# EAGLE schematic p0x2 (EAGLE 4.11)
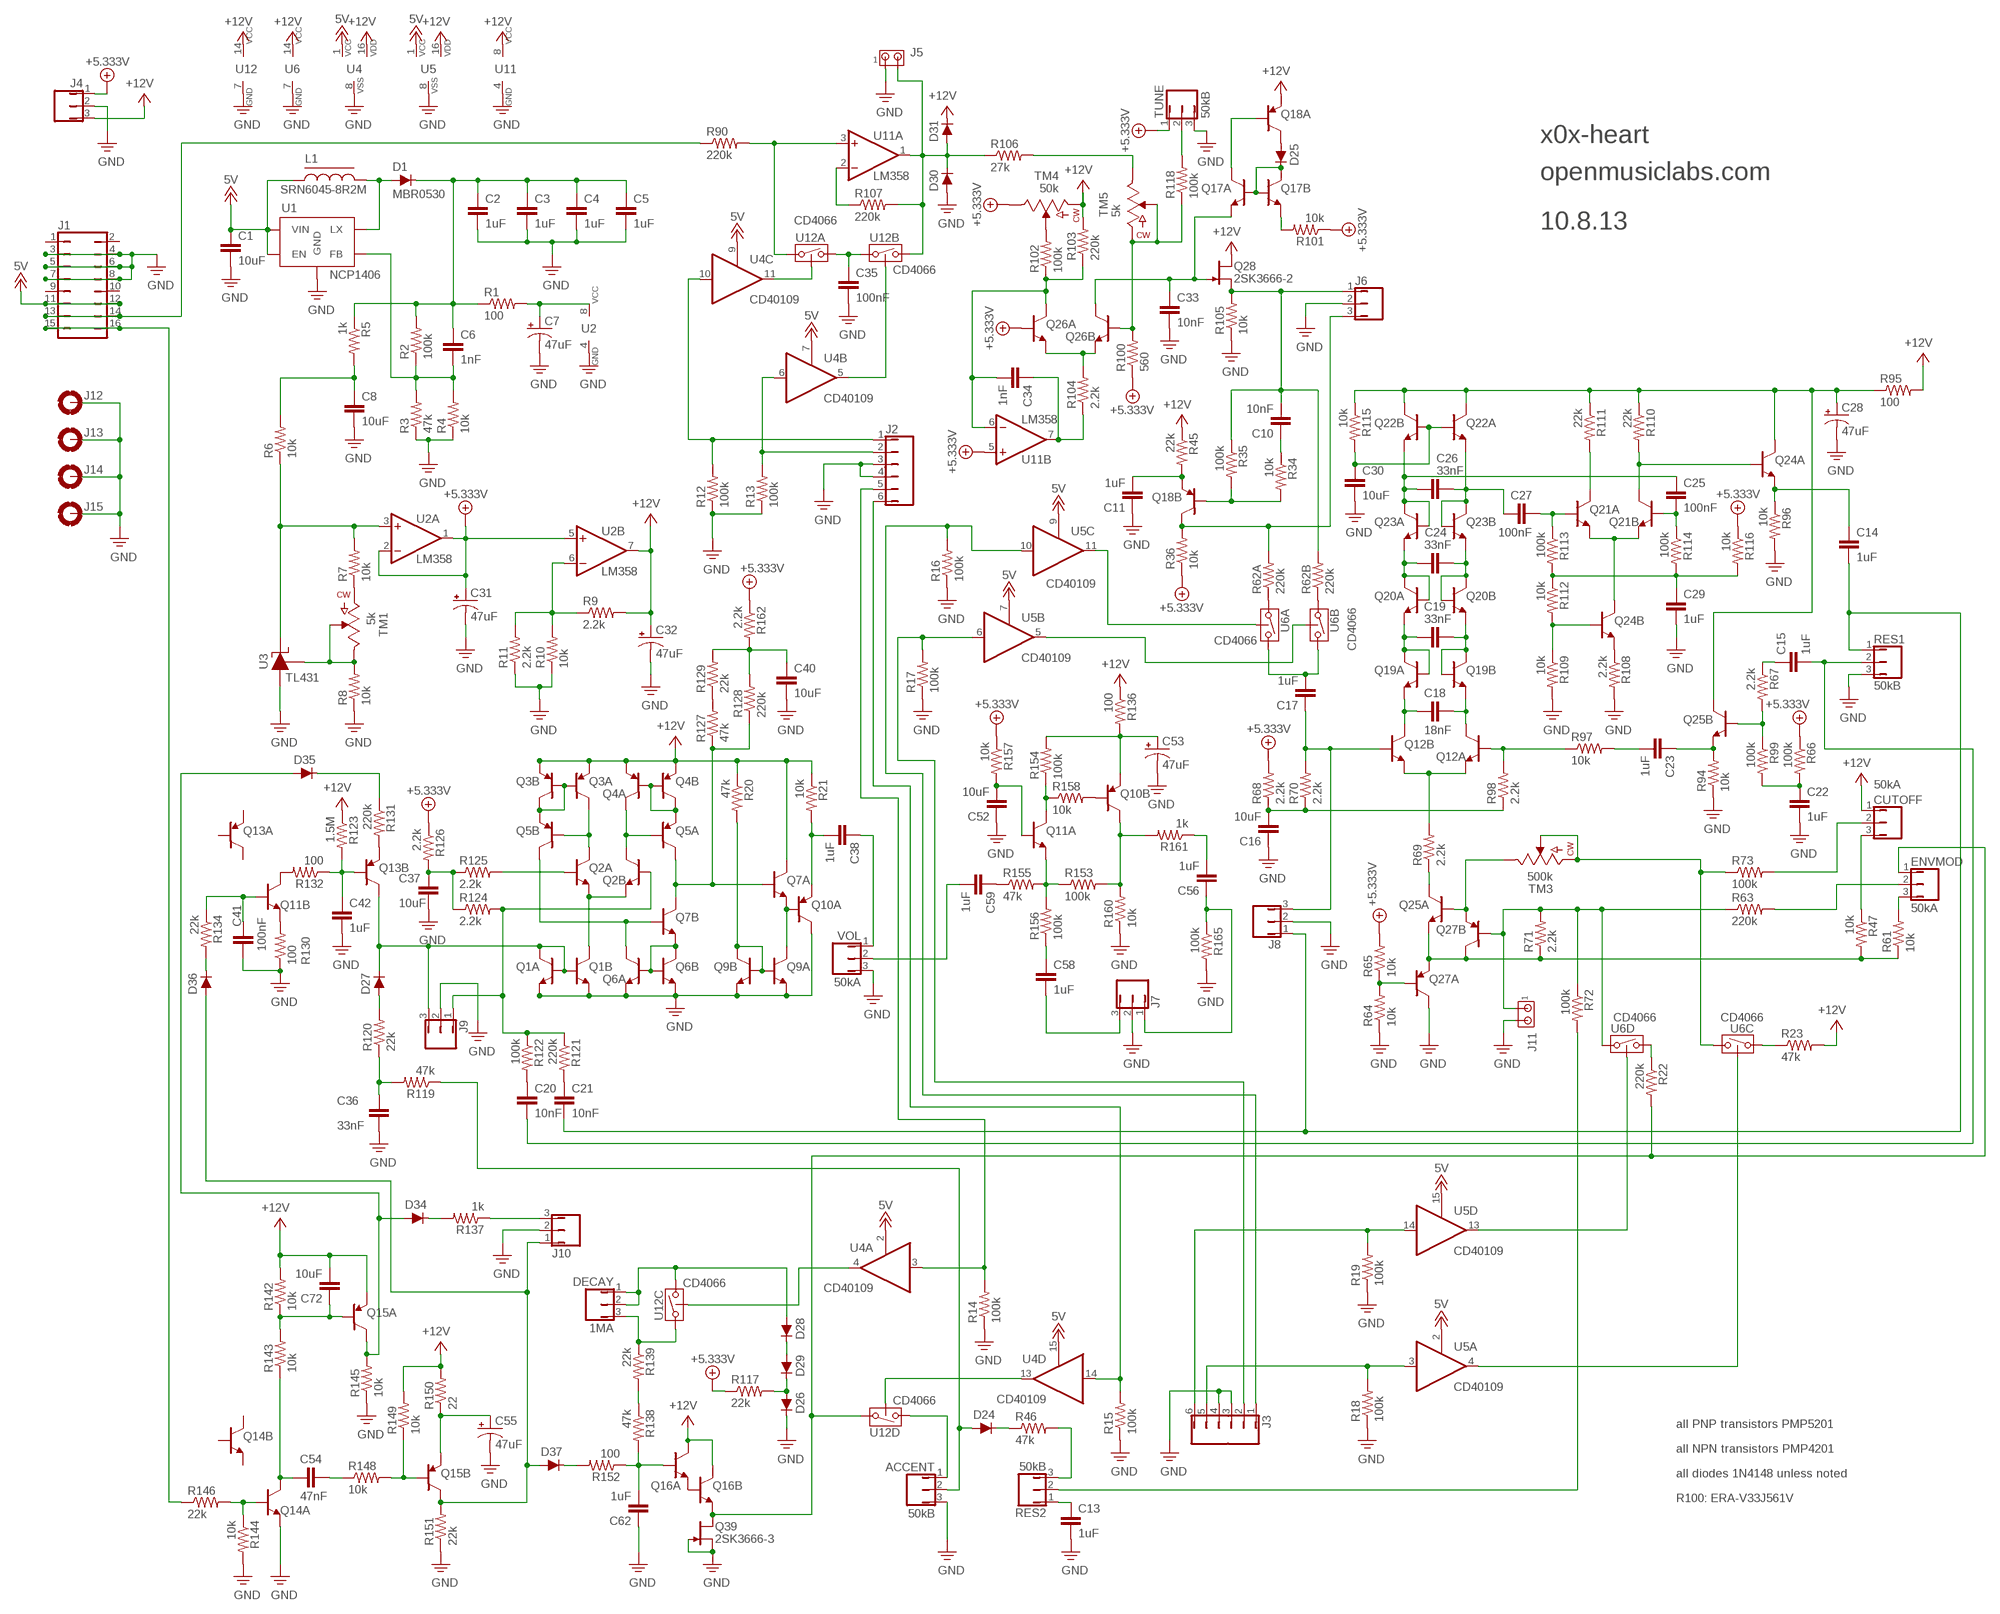
[diagram p0: schematic, sheet 1]

## Parts
ACCENT  50kB  JMP/3P/SIP  [JMP/3P/SIP]
C1  10uF  CAPACITOR0805-SM  [0805/SMALL]
C2  1uF  CAPACITOR0805-SM  [0805/SMALL]
C3  1uF  CAPACITOR0805-SM  [0805/SMALL]
C4  1uF  CAPACITOR0805-SM  [0805/SMALL]
C5  1uF  CAPACITOR0805-SM  [0805/SMALL]
C6  1nF  CAPACITOR0805-SM  [0805/SMALL]
C7  47uF  CAPACITOR-POL6.3X5.3/SMD  [CAP/6.3X5.3/SMD]
C8  10uF  CAPACITOR0805-SM  [0805/SMALL]
C10  10nF  CAPACITOR0805-SM  [0805/SMALL]
C11  1uF  CAPACITOR0805-SM  [0805/SMALL]
C13  1uF  CAPACITOR0805-SM  [0805/SMALL]
C14  1uF  CAPACITOR0805-SM  [0805/SMALL]
C15  1uF  CAPACITOR0805-SM  [0805/SMALL]
C16  10uF  CAPACITOR0805-SM  [0805/SMALL]
C17  1uF  CAPACITOR0805-SM  [0805/SMALL]
C18  18nF  CAPACITOR0805-SM  [0805/SMALL]
C19  33nF  CAPACITOR0805-SM  [0805/SMALL]
C20  10nF  CAPACITOR0805-SM  [0805/SMALL]
C21  10nF  CAPACITOR0805-SM  [0805/SMALL]
C22  1uF  CAPACITOR0805-SM  [0805/SMALL]
C23  1uF  CAPACITOR0805-SM  [0805/SMALL]
C24  33nF  CAPACITOR0805-SM  [0805/SMALL]
C25  100nF  CAPACITOR0805-SM  [0805/SMALL]
C26  33nF  CAPACITOR0805-SM  [0805/SMALL]
C27  100nF  CAPACITOR0805-SM  [0805/SMALL]
C28  47uF  CAPACITOR-POL6.3X5.3/SMD  [CAP/6.3X5.3/SMD]
C29  1uF  CAPACITOR0805-SM  [0805/SMALL]
C30  10uF  CAPACITOR0805-SM  [0805/SMALL]
C31  47uF  CAPACITOR-POL6.3X5.3/SMD  [CAP/6.3X5.3/SMD]
C32  47uF  CAPACITOR-POL6.3X5.3/SMD  [CAP/6.3X5.3/SMD]
C33  10nF  CAPACITOR0805-SM  [0805/SMALL]
C34  1nF  CAPACITOR0805-SM  [0805/SMALL]
C35  100nF  CAPACITOR0805-SM  [0805/SMALL]
C36  33nF  CAPACITOR0805-SM  [0805/SMALL]
C37  10uF  CAPACITOR0805-SM  [0805/SMALL]
C38  1uF  CAPACITOR0805-SM  [0805/SMALL]
C40  10uF  CAPACITOR0805-SM  [0805/SMALL]
C41  100nF  CAPACITOR0805-SM  [0805/SMALL]
C42  1uF  CAPACITOR0805-SM  [0805/SMALL]
C52  10uF  CAPACITOR0805-SM  [0805/SMALL]
C53  47uF  CAPACITOR-POL6.3X5.3/SMD  [CAP/6.3X5.3/SMD]
C54  47nF  CAPACITOR0805-SM  [0805/SMALL]
C55  47uF  CAPACITOR-POL6.3X5.3/SMD  [CAP/6.3X5.3/SMD]
C56  1uF  CAPACITOR0805-SM  [0805/SMALL]
C58  1uF  CAPACITOR0805-SM  [0805/SMALL]
C59  1uF  CAPACITOR0805-SM  [0805/SMALL]
C62  1uF  CAPACITOR0805-SM  [0805/SMALL]
C72  10uF  CAPACITOR0805-SM  [0805/SMALL]
CUTOFF  50kA  JMP/3P/SIP  [JMP/3P/SIP]
D1  MBR0530  DIODESOD-123  [SOD-123]
D24  DIODESOT23-3  [SOT-23-3]
D25  DIODESOT23-3  [SOT-23-3]
D26  DIODESOT23-3  [SOT-23-3]
D27  DIODESOT23-3  [SOT-23-3]
D28  DIODESOT23-3  [SOT-23-3]
D29  DIODESOT23-3  [SOT-23-3]
D30  DIODESOT23-3  [SOT-23-3]
D31  DIODESOT23-3  [SOT-23-3]
D34  DIODESOT23-3  [SOT-23-3]
D35  DIODESOT23-3  [SOT-23-3]
D36  DIODESOT23-3  [SOT-23-3]
D37  DIODESOT23-3  [SOT-23-3]
DECAY  1MA  JMP/3P/SIP  [JMP/3P/SIP]
ENVMOD  50kA  JMP/3P/SIP  [JMP/3P/SIP]
J1  JMP/16P/DIPDIP  [JMP/16P/DIP]
J2  JMP/6P/SIP  [JMP/6P/SIP]
J3  JMP/6P/SIP  [JMP/6P/SIP]
J4  JMP/3P/SIP  [JMP/3P/SIP]
J5  JMP/2P/SIP  [JMP/2P/SIP]
J6  JMP/3P/SIP  [JMP/3P/SIP]
J7  JMP/3P/SIP  [JMP/3P/SIP]
J8  JMP/3P/SIP  [JMP/3P/SIP]
J9  JMP/3P/SIP  [JMP/3P/SIP]
J10  JMP/3P/SIP  [JMP/3P/SIP]
J11  JMP/2P/SIP  [JMP/2P/SIP]
J12  HOLE-PAD4/40  [H0LE/PAD/4-40]
J13  HOLE-PAD4/40  [H0LE/PAD/4-40]
J14  HOLE-PAD4/40  [H0LE/PAD/4-40]
J15  HOLE-PAD4/40  [H0LE/PAD/4-40]
L1  SRN6045-8R2M  INDUCTORSRN6045  [SRN6045]
Q1  NPN-DUALPMP4201  [SOT363]
Q2  NPN-DUALPMP4201  [SOT363]
Q3  PNP-DUALPMP5201  [SOT363]
Q4  PNP-DUALPMP5201  [SOT363]
Q5  PNP-DUALPMP5201  [SOT363]
Q6  NPN-DUALPMP4201  [SOT363]
Q7  NPN-DUALPMP4201  [SOT363]
Q9  NPN-DUALPMP4201  [SOT363]
Q10  PNP-DUALPMP5201  [SOT363]
Q11  NPN-DUALPMP4201  [SOT363]
Q12  NPN-DUALPMP4201  [SOT363]
Q13  PNP-DUALPMP5201  [SOT363]
Q14  NPN-DUALPMP4201  [SOT363]
Q15  PNP-DUALPMP5201  [SOT363]
Q16  NPN-DUALPMP4201  [SOT363]
Q17  NPN-DUALPMP4201  [SOT363]
Q18  PNP-DUALPMP5201  [SOT363]
Q19  NPN-DUALPMP4201  [SOT363]
Q20  NPN-DUALPMP4201  [SOT363]
Q21  NPN-DUALPMP4201  [SOT363]
Q22  NPN-DUALPMP4201  [SOT363]
Q23  NPN-DUALPMP4201  [SOT363]
Q24  NPN-DUALPMP4201  [SOT363]
Q25  NPN-DUALPMP4201  [SOT363]
Q26  NPN-DUALPMP4201  [SOT363]
Q27  PNP-DUALPMP5201  [SOT363]
Q28  2SK3666-2  JFET/NSOT23-3  [SOT-23-3]
Q39  2SK3666-3  JFET/NSOT23-3  [SOT-23-3]
R1  100  RESISTOR0603-SM  [0603-SM]
R2  100k  RESISTOR0603-SM  [0603-SM]
R3  47k  RESISTOR0603-SM  [0603-SM]
R4  10k  RESISTOR0603-SM  [0603-SM]
R5  1k  RESISTOR0603-SM  [0603-SM]
R6  10k  RESISTOR0603-SM  [0603-SM]
R7  10k  RESISTOR0603-SM  [0603-SM]
R8  10k  RESISTOR0603-SM  [0603-SM]
R9  2.2k  RESISTOR0603-SM  [0603-SM]
R10  10k  RESISTOR0603-SM  [0603-SM]
R11  2.2k  RESISTOR0603-SM  [0603-SM]
R12  100k  RESISTOR0603-SM  [0603-SM]
R13  100k  RESISTOR0603-SM  [0603-SM]
R14  100k  RESISTOR0603-SM  [0603-SM]
R15  100k  RESISTOR0603-SM  [0603-SM]
R16  100k  RESISTOR0603-SM  [0603-SM]
R17  100k  RESISTOR0603-SM  [0603-SM]
R18  100k  RESISTOR0603-SM  [0603-SM]
R19  100k  RESISTOR0603-SM  [0603-SM]
R20  47k  RESISTOR0603-SM  [0603-SM]
R21  10k  RESISTOR0603-SM  [0603-SM]
R22  220k  RESISTOR0603-SM  [0603-SM]
R23  47k  RESISTOR0603-SM  [0603-SM]
R34  10k  RESISTOR0603-SM  [0603-SM]
R35  100k  RESISTOR0603-SM  [0603-SM]
R36  10k  RESISTOR0603-SM  [0603-SM]
R45  22k  RESISTOR0603-SM  [0603-SM]
R46  47k  RESISTOR0603-SM  [0603-SM]
R47  10k  RESISTOR0603-SM  [0603-SM]
R61  10k  RESISTOR0603-SM  [0603-SM]
R62A  220k  RESISTOR0603-SM  [0603-SM]
R62B  220k  RESISTOR0603-SM  [0603-SM]
R63  220k  RESISTOR0603-SM  [0603-SM]
R64  10k  RESISTOR0603-SM  [0603-SM]
R65  10k  RESISTOR0603-SM  [0603-SM]
R66  100k  RESISTOR0603-SM  [0603-SM]
R67  2.2k  RESISTOR0603-SM  [0603-SM]
R68  2.2k  RESISTOR0603-SM  [0603-SM]
R69  2.2k  RESISTOR0603-SM  [0603-SM]
R70  2.2k  RESISTOR0603-SM  [0603-SM]
R71  2.2k  RESISTOR0603-SM  [0603-SM]
R72  100k  RESISTOR0603-SM  [0603-SM]
R73  100k  RESISTOR0603-SM  [0603-SM]
R90  220k  RESISTOR0603-SM  [0603-SM]
R94  10k  RESISTOR0603-SM  [0603-SM]
R95  100  RESISTOR0603-SM  [0603-SM]
R96  10k  RESISTOR0603-SM  [0603-SM]
R97  10k  RESISTOR0603-SM  [0603-SM]
R98  2.2k  RESISTOR0603-SM  [0603-SM]
R99  100k  RESISTOR0603-SM  [0603-SM]
R100  560  RESISTOR0603-SM  [0603-SM]
R101  10k  RESISTOR0603-SM  [0603-SM]
R102  100k  RESISTOR0603-SM  [0603-SM]
R103  220k  RESISTOR0603-SM  [0603-SM]
R104  2.2k  RESISTOR0603-SM  [0603-SM]
R105  10k  RESISTOR0603-SM  [0603-SM]
R106  27k  RESISTOR0603-SM  [0603-SM]
R107  220k  RESISTOR0603-SM  [0603-SM]
R108  2.2k  RESISTOR0603-SM  [0603-SM]
R109  10k  RESISTOR0603-SM  [0603-SM]
R110  22k  RESISTOR0603-SM  [0603-SM]
R111  22k  RESISTOR0603-SM  [0603-SM]
R112  10k  RESISTOR0603-SM  [0603-SM]
R113  100k  RESISTOR0603-SM  [0603-SM]
R114  100k  RESISTOR0603-SM  [0603-SM]
R115  10k  RESISTOR0603-SM  [0603-SM]
R116  10k  RESISTOR0603-SM  [0603-SM]
R117  22k  RESISTOR0603-SM  [0603-SM]
R118  100k  RESISTOR0603-SM  [0603-SM]
R119  47k  RESISTOR0603-SM  [0603-SM]
R120  22k  RESISTOR0603-SM  [0603-SM]
R121  220k  RESISTOR0603-SM  [0603-SM]
R122  100k  RESISTOR0603-SM  [0603-SM]
R123  1.5M  RESISTOR0603-SM  [0603-SM]
R124  2.2k  RESISTOR0603-SM  [0603-SM]
R125  2.2k  RESISTOR0603-SM  [0603-SM]
R126  2.2k  RESISTOR0603-SM  [0603-SM]
R127  47k  RESISTOR0603-SM  [0603-SM]
R128  220k  RESISTOR0603-SM  [0603-SM]
R129  22k  RESISTOR0603-SM  [0603-SM]
R130  100  RESISTOR0603-SM  [0603-SM]
R131  220k  RESISTOR0603-SM  [0603-SM]
R132  100  RESISTOR0603-SM  [0603-SM]
R134  22k  RESISTOR0603-SM  [0603-SM]
R136  100  RESISTOR0603-SM  [0603-SM]
R137  1k  RESISTOR0603-SM  [0603-SM]
R138  47k  RESISTOR0603-SM  [0603-SM]
R139  22k  RESISTOR0603-SM  [0603-SM]
R142  10k  RESISTOR0603-SM  [0603-SM]
R143  10k  RESISTOR0603-SM  [0603-SM]
R144  10k  RESISTOR0603-SM  [0603-SM]
R145  10k  RESISTOR0603-SM  [0603-SM]
R146  22k  RESISTOR0603-SM  [0603-SM]
R148  10k  RESISTOR0603-SM  [0603-SM]
R149  10k  RESISTOR0603-SM  [0603-SM]
R150  22  RESISTOR0603-SM  [0603-SM]
R151  22k  RESISTOR0603-SM  [0603-SM]
R152  100  RESISTOR0603-SM  [0603-SM]
R153  100k  RESISTOR0603-SM  [0603-SM]
R154  100k  RESISTOR0603-SM  [0603-SM]
R155  47k  RESISTOR0603-SM  [0603-SM]
R156  100k  RESISTOR0603-SM  [0603-SM]
R157  10k  RESISTOR0603-SM  [0603-SM]
R158  10k  RESISTOR0603-SM  [0603-SM]
R160  10k  RESISTOR0603-SM  [0603-SM]
R161  1k  RESISTOR0603-SM  [0603-SM]
R162  2.2k  RESISTOR0603-SM  [0603-SM]
R165  100k  RESISTOR0603-SM  [0603-SM]
RES1  50kB  JMP/3P/SIP  [JMP/3P/SIP]
RES2  50kB  JMP/3P/SIP  [JMP/3P/SIP]
TM1  5k  POT/TRIMTC33X  [TC33X]
TM3  500k  POT/TRIMTC33X  [TC33X]
TM4  50k  POT/TRIMTC33X  [TC33X]
TM5  5k  POT/TRIMTC33X  [TC33X]
TUNE  50kB  JMP/3P/SIP  [JMP/3P/SIP]
U1  NCP1406  NCP1406SOT23-5  [SOT23-5]
U2  LM358  OPAMP/DUALSOIC  [8-SOIC]
U3  TL431  TL431SOT23-3  [SOT-23-3]
U4  CD40109  CD40109WIDE  [16-SOIC/WIDE]
U5  CD40109  CD40109WIDE  [16-SOIC/WIDE]
U6  CD4066  CD4066SOIC  [14-SOIC]
U11  LM358  OPAMP/DUALSOIC  [8-SOIC]
U12  CD4066  CD4066SOIC  [14-SOIC]
VOL  50kA  JMP/3P/SIP  [JMP/3P/SIP]

## Nets
+5V: C31.P$1(+) J4.1 Q26.P$1 R36.P$1 R65.P$2 R66.P$1 R68.P$2 R100.P$1 R101.P$1 R116.P$1 R117.P$1 R126.P$1 R157.P$1 R162.P$1 TM4.P$3 TUNE.1 U2.1(A:OUT) U2.2(A:-IN) U2.5(B:+IN) U11.5(B:+IN) ; supply symbol labelled +5.333V
+12V: C1.1 J1.11 J1.12 L1.P$1 U1.P$1(EN) U1.P$3(VIN) U4.1(VCC) U4.2(A:OE) U4.7(B:OE) U4.9(C:OE) U4.15(D:OE) U5.1(VCC) U5.2(A:OE) U5.7(B:OE) U5.9(C:OE) U5.15(D:OE) ; supply symbol labelled 5V
ENVMOD: ENVMOD.1 Q16.P$4 Q39.P$2 R22.P$2 U12.10
N$1: J10.3 R137.P$1
N$2: R138.P$1 R139.P$2
N$3: R22.P$1 U6.11
N$4: R90.P$2 U11.3(A:+IN) U12.1
N$5: D30.P$1(C) D31.P$3(A) J5.2 R106.P$1 R107.P$2 U11.1(A:OUT) U12.4
N$6: R107.P$1 U11.2(A:-IN)
N$7: Q26.P$4 Q26.P$5 R104.P$2
N$8: C34.1 R104.P$1 U11.7(B:OUT)
N$9: C34.2 Q26.P$6 R102.P$1 R103.P$1 U11.6(B:-IN)
N$10: R106.P$2 TM5.P$3
N$11: C33.1 Q17.P$5 Q26.P$3 Q28.P$1
N$12: R62A.P$1 U6.1
N$13: C13.1 RES2.1
N$14: C10.2 J6.1 Q28.P$3 R35.P$1 R62B.P$2 R105.P$2
N$15: Q17.P$4 R101.P$2
N$16: D25.P$3(A) Q18.P$6
N$17: D25.P$1(C) Q17.P$1 Q17.P$2 Q17.P$3
N$18: Q17.P$6 Q18.P$1
N$19: C11.2 Q18.P$4 R45.P$2
N$20: J6.3 Q18.P$3 R36.P$2 R62A.P$2
N$21: Q18.P$2 R34.P$2 R35.P$2
N$22: R62B.P$1 U6.3
N$23: C10.1 R34.P$1
N$24: C17.1 J8.3 Q12.P$2 R70.P$2
N$25: Q12.P$4 Q12.P$5 R69.P$2
N$26: C18.2 Q12.P$3 Q19.P$5
N$27: C19.2 Q19.P$1 Q19.P$6 Q20.P$5
N$28: C24.2 Q20.P$1 Q20.P$6 Q23.P$5
N$29: C19.1 Q19.P$2 Q19.P$3 Q20.P$4
N$30: C18.1 Q12.P$6 Q19.P$4
N$31: C24.1 Q20.P$2 Q20.P$3 Q23.P$4
N$32: C26.1 C27.2 Q22.P$5 Q23.P$2 Q23.P$3
N$33: C25.1 C26.2 Q22.P$4 Q23.P$1 Q23.P$6
N$34: C30.1 Q22.P$1 Q22.P$2 R115.P$2
N$35: C16.2 R68.P$1 R70.P$1 R98.P$1
N$36: Q12.P$1 R97.P$1 R98.P$2
N$37: Q25.P$5 Q27.P$3 Q27.P$5 R47.P$2 R61.P$1 R71.P$1
N$38: Q27.P$1 R64.P$2 R65.P$1
N$39: Q25.P$1 Q27.P$4 TM3.P$3
N$40: J1.13 J1.14 R90.P$1
N$41: Q25.P$6 R69.P$1
N$42: C28.P$1(+) Q22.P$3 Q22.P$6 Q24.P$6 Q25.P$3 R95.P$1 R110.P$1 R111.P$1 R115.P$1
N$43: C25.2 Q21.P$2 R114.P$1
N$44: Q21.P$4 Q21.P$5 Q24.P$3
N$45: Q21.P$3 Q24.P$1 R110.P$2
N$46: Q21.P$6 R111.P$2
N$47: C29.1 R112.P$1 R113.P$2 R114.P$2 R116.P$2
N$48: C27.1 Q21.P$1 R113.P$1
N$49: C14.1 Q24.P$5 R96.P$1
N$50: Q24.P$4 R108.P$1
N$51: Q24.P$2 R109.P$1 R112.P$2
N$52: C14.2 C21.2 J8.1 RES1.1
N$53: R73.P$1 TM3.P$1 TM3.P$2 U6.9
N$54: C15.2 C20.2 RES1.2
N$55: C15.1 R67.P$1
N$56: CUTOFF.2 R73.P$2
N$57: C22.1 R66.P$2 R99.P$2
N$58: C23.1 Q25.P$4 R94.P$2
N$59: ENVMOD.3 R61.P$2
N$60: CUTOFF.3 R47.P$1
N$61: ENVMOD.2 R63.P$2
N$62: R72.P$2 RES2.2
N$63: J2.2 R13.P$2 U4.6(B:I)
N$64: D28.P$1(C) D29.P$3(A)
N$65: Q16.P$2 Q16.P$5
N$66: D26.P$3(A) D29.P$1(C) R117.P$2
N$67: C62.2 Q16.P$1 R138.P$2 R152.P$1
N$68: D37.P$1(C) R152.P$2
N$69: DECAY.3 R139.P$1 U12.8
N$71: D28.P$3(A) DECAY.1 DECAY.2 U12.9
N$72: C35.1 U12.2 U12.3
N$73: U4.5(B:O) U12.5
N$74: U4.11(C:O) U12.13
N$75: C17.2 U6.2 U6.4
N$76: U4.4(A:O) U12.6
N$77: C58.1 R156.P$1
N$78: ACCENT.1 U12.11
N$79: ACCENT.2 D24.P$3(A) R119.P$1
N$80: R46.P$2 RES2.3
N$81: D24.P$1(C) R46.P$1
N$82: U4.13(D:O) U12.12
N$83: J11.1 Q27.P$2 R63.P$1 R71.P$2 R72.P$1 U6.10
N$84: Q14.P$1 R144.P$1 R146.P$2
N$85: C54.2 Q14.P$6 R143.P$1
N$86: U5.5(B:O) U6.5
N$87: D27.P$1(C) J9.3 Q1.P$1 Q1.P$2 Q1.P$6 Q13.P$3
N$88: U5.11(C:O) U6.13
N$89: Q15.P$2 R148.P$2 R149.P$1
N$90: C55.P$1(+) Q15.P$4 R150.P$1
N$91: Q1.P$3 Q2.P$4 Q2.P$5
N$92: D36.P$3(A) D37.P$3(A) J10.1 Q15.P$3 R151.P$2
N$93: D34.P$3(A) D35.P$3(A) Q15.P$6 R145.P$2
N$94: Q4.P$1 Q4.P$2 Q4.P$3 Q5.P$5
N$95: Q3.P$1 Q3.P$2 Q3.P$3 Q5.P$4
N$96: Q2.P$3 Q4.P$6 Q5.P$1
N$97: Q6.P$1 Q6.P$2 Q6.P$3 Q7.P$4
N$98: Q5.P$6 Q7.P$1 Q7.P$3 R127.P$1 R128.P$1
N$99: Q13.P$4 R131.P$2
N$100: Q2.P$6 Q3.P$6 Q5.P$2
N$101: Q5.P$3 Q6.P$6 Q7.P$2
N$102: Q9.P$1 Q9.P$2 Q9.P$3 R20.P$2
N$103: Q7.P$5 Q9.P$6 Q10.P$1
N$104: C56.1 J7.1 R165.P$1
N$105: C38.2 Q10.P$5 R21.P$2
N$106: C38.1 VOL.1
N$107: C59.2 VOL.2
N$108: C59.1 R155.P$1
N$109: C52.2 Q11.P$1 R157.P$2
N$110: Q10.P$2 R158.P$2
N$111: Q10.P$3 R153.P$2 R160.P$2 R161.P$2
N$112: Q11.P$5 R153.P$1 R155.P$2 R156.P$2
N$113: Q11.P$6 R154.P$1 R158.P$1
N$114: C53.P$1(+) Q10.P$4 R136.P$2 R154.P$2
N$115: C56.2 R161.P$1
N$116: R127.P$2 R129.P$1
N$117: J1.15 J1.16 R146.P$1
N$118: C40.1 R128.P$2 R129.P$2 R162.P$2
N$119: C42.1 Q13.P$2 R123.P$2 R132.P$1
N$120: Q11.P$3 R132.P$2
N$121: Q11.P$4 R130.P$2
N$122: C41.1 Q11.P$2 R134.P$1
N$123: D36.P$1(C) R134.P$2
N$124: D35.P$1(C) R131.P$1
N$125: D27.P$3(A) R120.P$2
N$126: C36.1 R119.P$2 R120.P$1
N$127: J9.1 Q2.P$2 R121.P$1 R122.P$1 R124.P$2
N$128: Q2.P$1 R125.P$2
N$129: C37.1 R124.P$1 R125.P$1 R126.P$2
N$130: C21.1 R121.P$2
N$131: C20.1 R122.P$2
N$132: C23.2 R97.P$2
N$133: U5.13(D:O) U6.12
N$134: U5.4(A:O) U6.6
N$135: C7.P$1(+) R1.P$2 U2.8(VCC)
N$136: C6.2 R2.P$1 R3.P$2 R4.P$2 U1.P$2(FB)
N$138: R102.P$2 TM4.P$2
N$139: D1.P$2(A) L1.P$2 U1.P$5(LX)
N$140: Q26.P$2 R100.P$2 R118.P$1 TM5.P$1 TM5.P$2
N$141: R23.P$1 U6.8
N$143: R7.P$1 TM1.P$1
N$144: R9.P$1 R10.P$2 R11.P$2 U2.6(B:-IN)
N$145: C58.2 J7.3
N$146: R6.P$1 R7.P$2 U2.3(A:+IN) U3.P$3
N$147: C8.1 R5.P$2 R6.P$2
N$148: R118.P$2 TUNE.2
N$149: D34.P$1(C) R137.P$2
N$150: Q25.P$2 R67.P$2 R99.P$1
N$151: J2.1 R12.P$2 U4.10(C:I)
N$152: J3.6 R19.P$2 U5.14(D:I)
N$153: J3.1 R16.P$2 U5.10(C:I)
N$154: J3.2 R17.P$2 U5.6(B:I)
N$155: J3.5 R18.P$2 U5.3(A:I)
N$158: C2.1 C3.1 C4.1 C5.1 C6.1 D1.P$1(C) R1.P$1 R2.P$2 R5.P$1
N$159: R8.P$2 TM1.P$2 TM1.P$3 U3.P$2
N$160: J2.6 R15.P$2 U4.14(D:I)
N$161: J2.5 R14.P$2 U4.3(A:I)
PE: ACCENT.3 C1.2 C2.2 C3.2 C4.2 C5.2 C7.P$2(-) C8.2 C11.1 C13.2 C16.1 C22.2 C28.P$2(-) C29.2 C30.2 C31.P$2(-) C32.P$2(-) C33.2 C35.2 C36.2 C37.2 C40.2 C41.2 C42.2 C52.1 C53.P$2(-) C55.P$2(-) C62.1 D26.P$1(C) D30.P$3(A) J1.3 J1.4 J1.5 J1.6 J1.7 J1.8 J2.3 J2.4 J3.3 J3.4 J4.2 J5.1 J6.2 J7.2 J8.2 J9.2 J10.2 J11.2 J12.P$1(MOUNT) J13.P$1(MOUNT) J14.P$1(MOUNT) J15.P$1(MOUNT) Q1.P$4 Q1.P$5 Q6.P$4 Q6.P$5 Q9.P$4 Q9.P$5 Q10.P$6 Q14.P$5 Q27.P$6 Q39.P$1 Q39.P$3 R3.P$1 R4.P$1 R8.P$1 R10.P$1 R11.P$1 R12.P$1 R13.P$1 R14.P$1 R15.P$1 R16.P$1 R17.P$1 R18.P$1 R19.P$1 R64.P$1 R94.P$1 R96.P$2 R105.P$1 R108.P$2 R109.P$2 R130.P$1 R144.P$2 R145.P$1 R151.P$1 R160.P$1 R165.P$2 RES1.3 TUNE.3 U1.P$4(GND) U2.4(GND) U3.P$1 U4.8(VSS) U5.8(VSS) U6.7(GND) U11.4(GND) U12.7(GND) VOL.3 ; supply symbol labelled GND
R52: C54.1 R148.P$1
R62: C72.1 Q15.P$1 R142.P$1 R143.P$2
V+: C32.P$1(+) C72.2 CUTOFF.1 D31.P$1(C) J4.3 Q3.P$4 Q3.P$5 Q4.P$4 Q4.P$5 Q7.P$6 Q15.P$5 Q16.P$3 Q16.P$6 Q18.P$5 Q28.P$2 R9.P$2 R20.P$1 R21.P$1 R23.P$2 R45.P$1 R95.P$2 R103.P$2 R123.P$1 R136.P$1 R142.P$2 R149.P$2 R150.P$2 TM4.P$1 U2.7(B:OUT) U4.16(VDD) U5.16(VDD) U6.14(VCC) U11.8(VCC) U12.14(VCC) ; supply symbol labelled +12V
Unconnected: J1.1 J1.2 J1.9 J1.10 Q13.P$1 Q13.P$5 Q13.P$6 Q14.P$2 Q14.P$3 Q14.P$4

## Notes on the sheet
- x0x-heart
- openmusiclabs.com
- 10.8.13
- all PNP transistors PMP5201
- all NPN transistors PMP4201
- all diodes 1N4148 unless noted
- R100: ERA-V33J561V

## Library data of the parts
ACCENT CUTOFF DECAY ENVMOD J4 J6-J10 RES1 RES2 TUNE VOL = audioint:JMP/3P/SIP
C1-C6 C8 C10 C11 C13-C27 C29 C30 C33-C38 C40-C42 C52 C54 C56 C58 C59 C62 C72 = audioint:CAPACITOR
C7 C28 C31 C32 C53 C55 = audioint:CAPACITOR-POL
D1 D24-D31 D34-D37 = audioint:DIODE
J1 = audioint:JMP/16P/DIP
J2 J3 = audioint:JMP/6P/SIP
J5 J11 = audioint:JMP/2P/SIP
J12-J15 = audioint:HOLE-PAD
L1 = audioint:INDUCTOR
Q1 Q2 Q6 Q7 Q9 Q11 Q12 Q14 Q16 Q17 Q19-Q26 = audioint:NPN-DUAL
Q3-Q5 Q10 Q13 Q15 Q18 Q27 = audioint:PNP-DUAL
Q28 Q39 = audioint:JFET/N
R1-R23 R34-R36 R45-R47 R61 R62A R62B R63-R73 R90 R94-R132 R134 R136-R139 R142-R146 R148-R158 R160-R162 R165 = audioint:RESISTOR
TM1 TM3-TM5 = audioint:POT/TRIM
U1 = audioint:NCP1406
U2 U11 = audioint:OPAMP/DUAL
U3 = audioint:TL431
U4 U5 = audioint:CD40109
U6 U12 = audioint:CD4066